# Altium schematic sheet IO.SchDoc
size A4
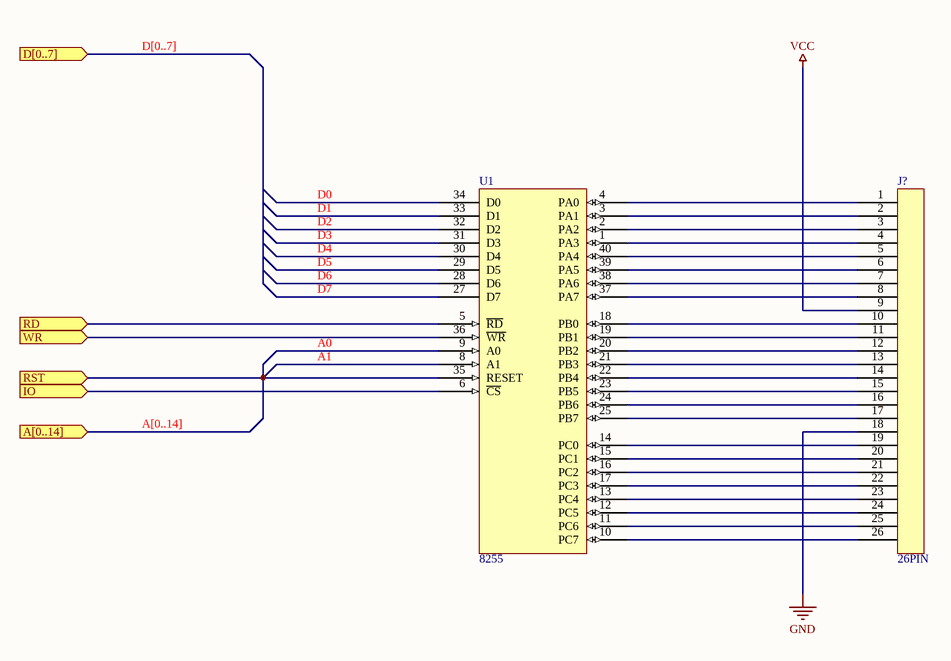
[diagram p0: IO.SchDoc]

## Parts
J?  26PIN  [IDC26]
U1  8255  [DIP40]

## Ports
A[0..14] (in), D[0..7] (in), IO (in), RD (in), RST (in), WR (in)

## Nets
GND: J?.18 U1.7(GND)
VCC: J?.9 U1.26(VCC)
IO: U1.6(~{CS}) ; port IO
RD: U1.5(~{RD}) ; port RD
RST: U1.8(A1) U1.35(RESET) ; port RST
WR: U1.36(~{WR}) ; port WR
NetJ?_1: J?.1 U1.4(PA0)
NetJ?_2: J?.2 U1.3(PA1)
NetJ?_3: J?.3 U1.2(PA2)
NetJ?_4: J?.4 U1.1(PA3)
NetJ?_5: J?.5 U1.40(PA4)
NetJ?_6: J?.6 U1.39(PA5)
NetJ?_7: J?.7 U1.38(PA6)
NetJ?_8: J?.8 U1.37(PA7)
NetJ?_10: J?.10 U1.18(PB0)
NetJ?_11: J?.11 U1.19(PB1)
NetJ?_12: J?.12 U1.20(PB2)
NetJ?_13: J?.13 U1.21(PB3)
NetJ?_14: J?.14 U1.22(PB4)
NetJ?_15: J?.15 U1.23(PB5)
NetJ?_16: J?.16 U1.24(PB6)
NetJ?_17: J?.17 U1.25(PB7)
NetJ?_19: J?.19 U1.14(PC0)
NetJ?_20: J?.20 U1.15(PC1)
NetJ?_21: J?.21 U1.16(PC2)
NetJ?_22: J?.22 U1.17(PC3)
NetJ?_23: J?.23 U1.13(PC4)
NetJ?_24: J?.24 U1.12(PC5)
NetJ?_25: J?.25 U1.11(PC6)
NetJ?_26: J?.26 U1.10(PC7)

Not connected (* = marked no-connect by the designer): U1 9(A0) 27(D7) 28(D6) 29(D5) 30(D4) 31(D3) 32(D2) 33(D1) 34(D0)

## Notes on the sheet
- D[0..7]
- D0
- D1
- D2
- D3
- D4
- D5
- D6
- D7
- A0
- A1
- A[0..14]